# Altium schematic sheet Breakoutboard.SchDoc
size 699 x 500 mm; SheetNumber: 1; SheetTotal: 1
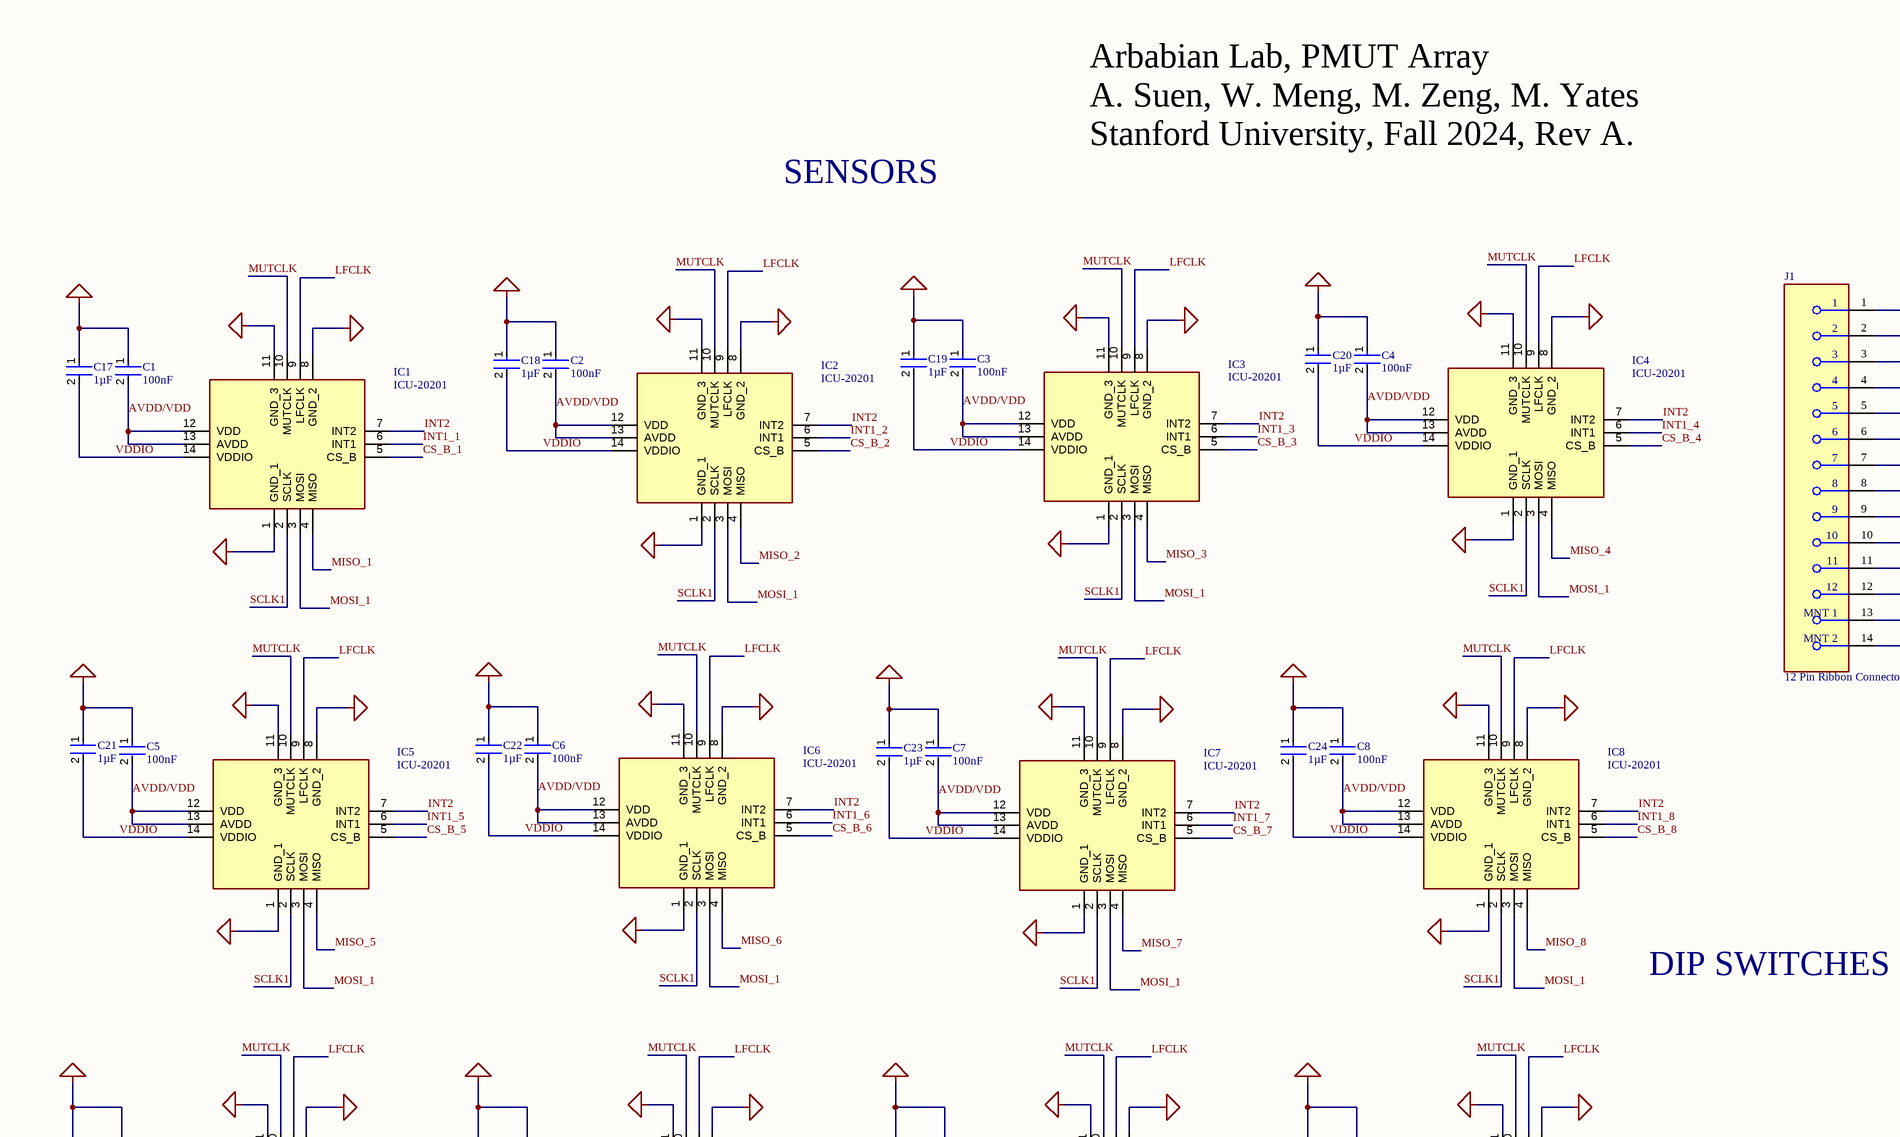
[diagram p0: Breakoutboard.SchDoc, top left]
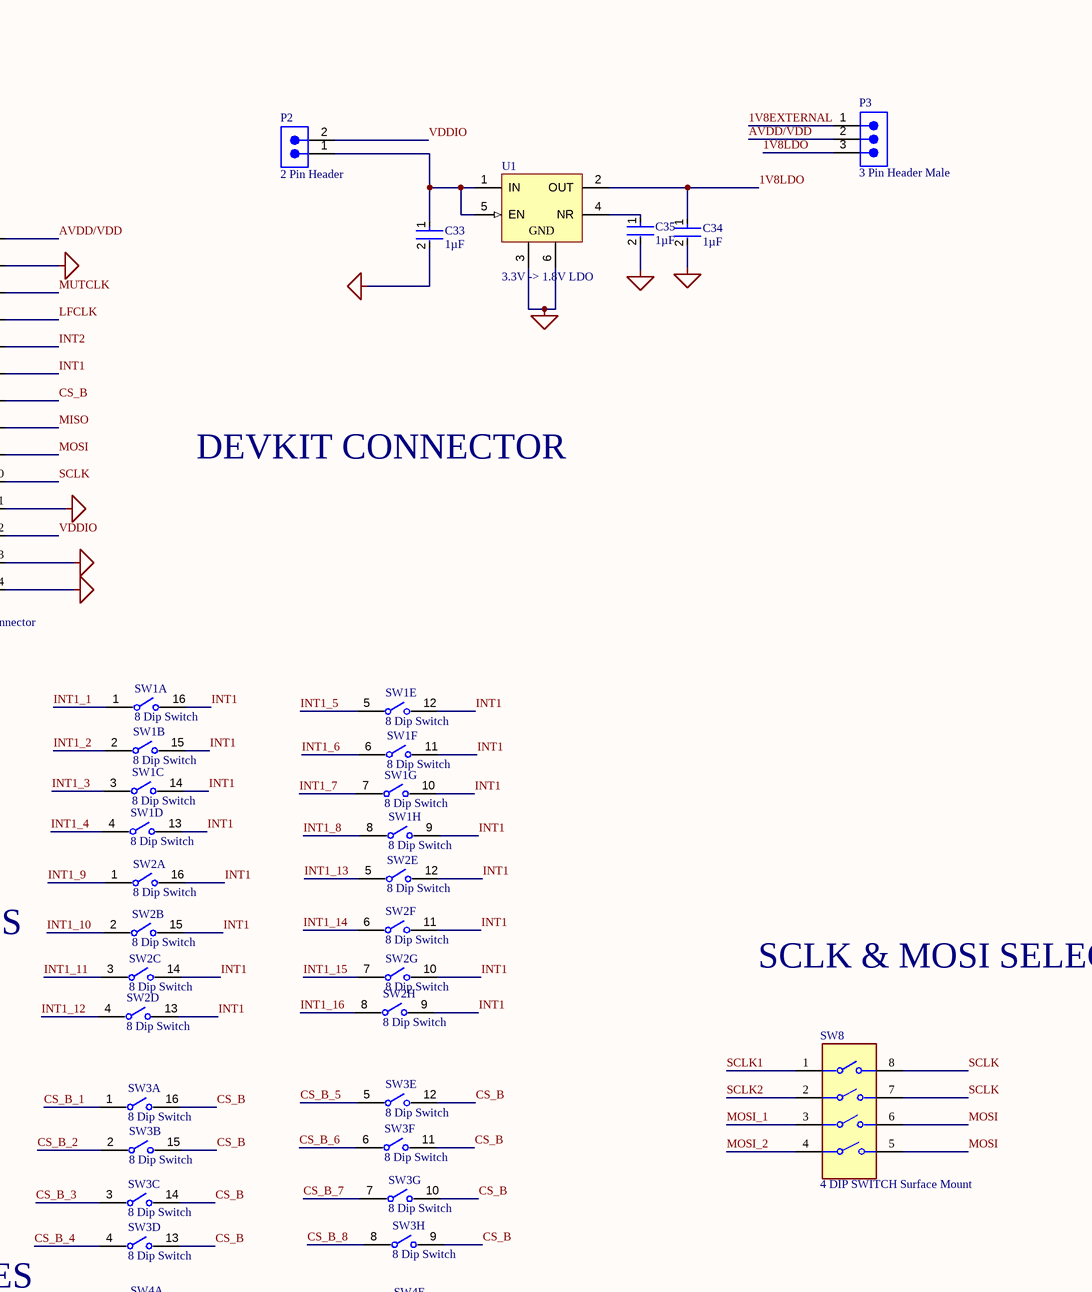
[diagram p1: Breakoutboard.SchDoc, top right]
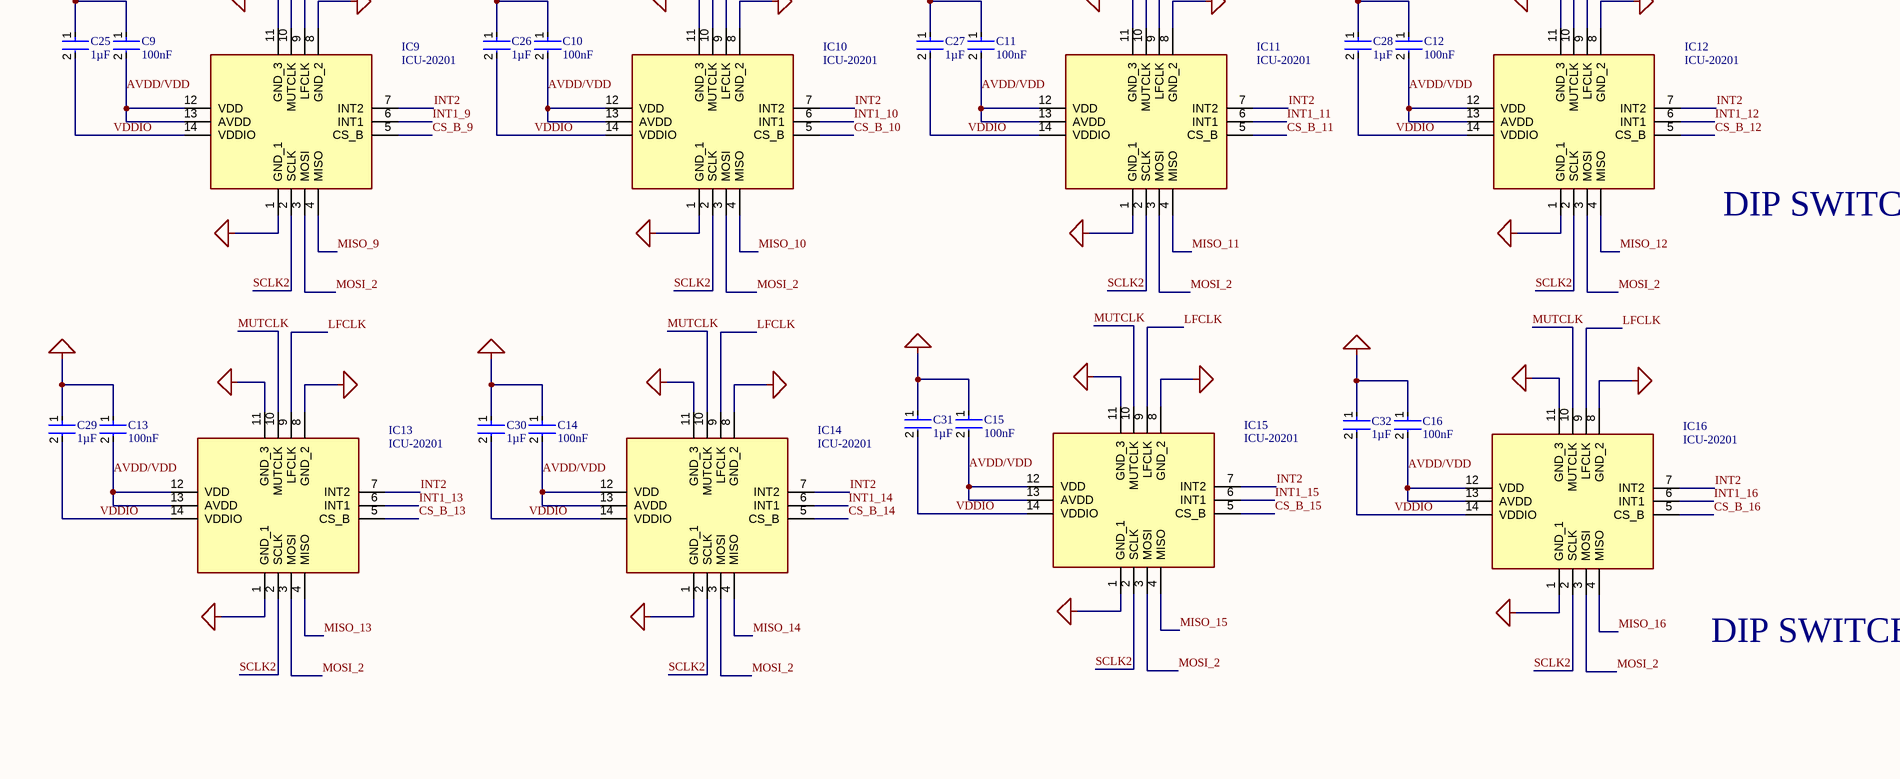
[diagram p2: Breakoutboard.SchDoc, bottom left]
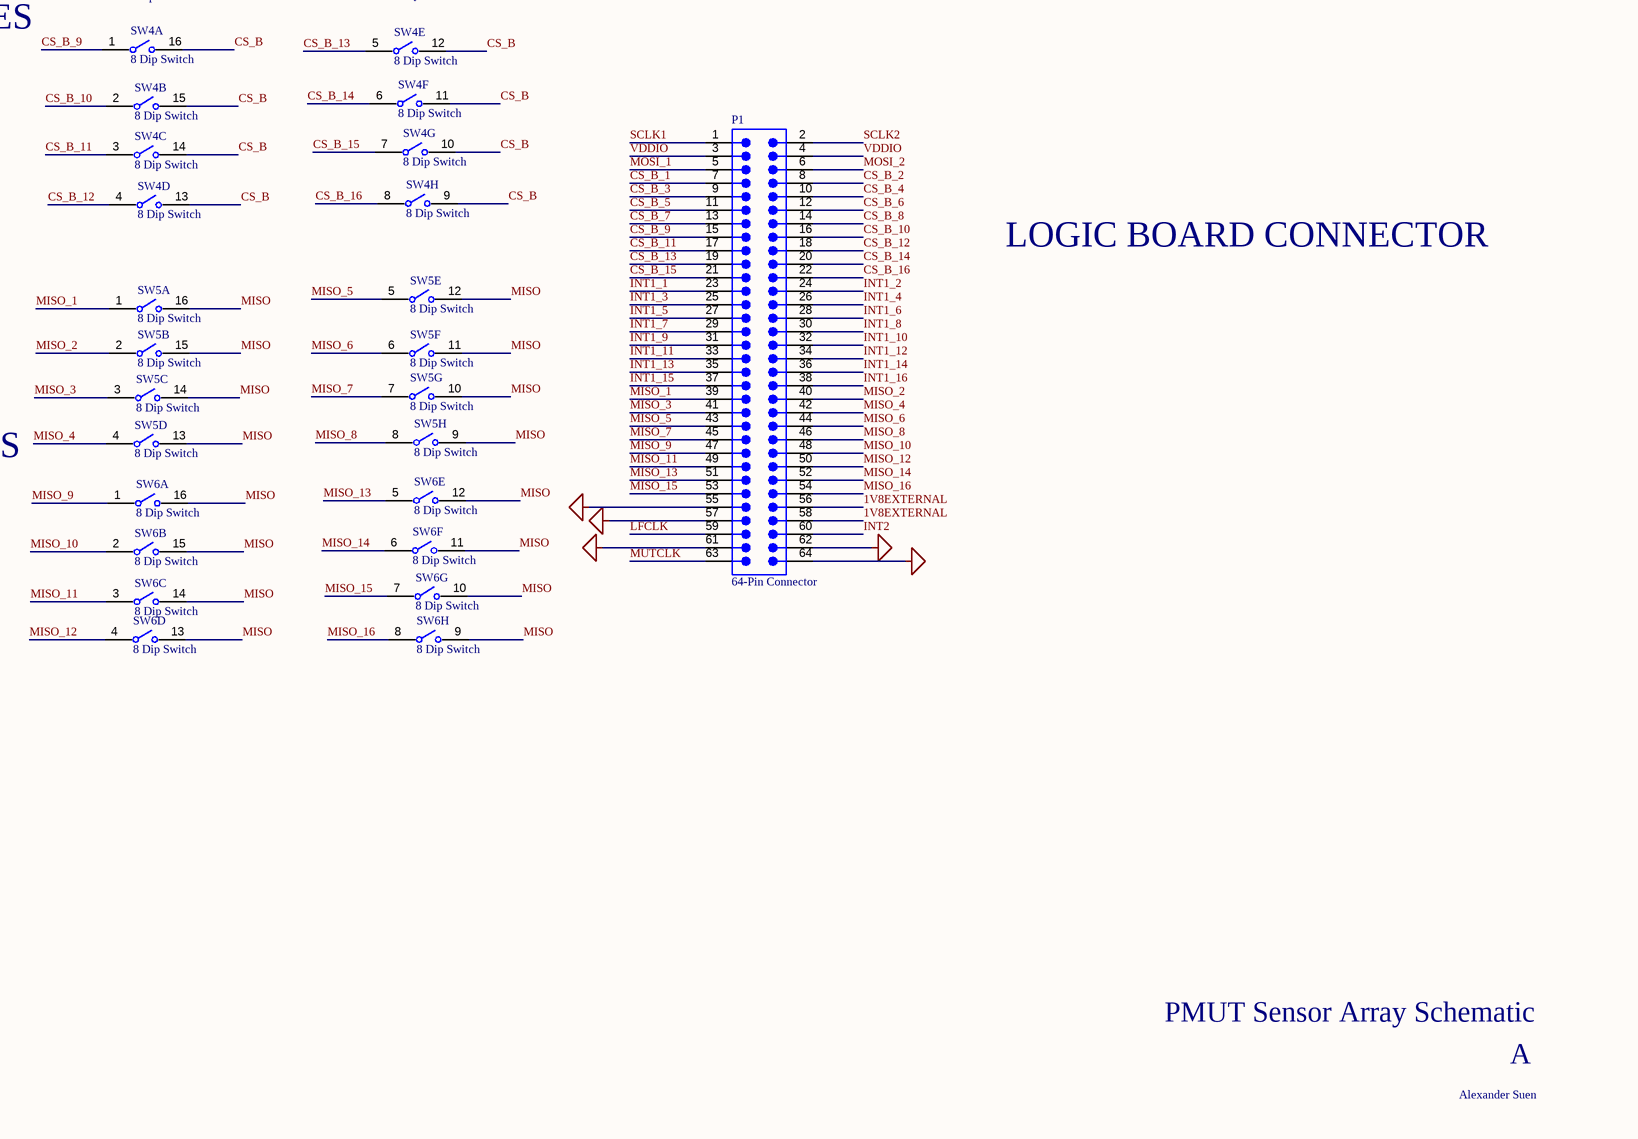
[diagram p3: Breakoutboard.SchDoc, bottom right]

## Parts
C1  value 100nF  [FP-CL17-IPC_B]  (hidden comment: 0.1 uF Capacitator)
C2  value 100nF  [FP-CL17-IPC_B]  (hidden comment: 0.1 uF Capacitator)
C3  value 100nF  [FP-CL17-IPC_B]  (hidden comment: 0.1 uF Capacitator)
C4  value 100nF  [FP-CL17-IPC_B]  (hidden comment: 0.1 uF Capacitator)
C5  value 100nF  [FP-CL17-IPC_B]  (hidden comment: 0.1 uF Capacitator)
C6  value 100nF  [FP-CL17-IPC_B]  (hidden comment: 0.1 uF Capacitator)
C7  value 100nF  [FP-CL17-IPC_B]  (hidden comment: 0.1 uF Capacitator)
C8  value 100nF  [FP-CL17-IPC_B]  (hidden comment: 0.1 uF Capacitator)
C9  value 100nF  [FP-CL17-IPC_B]  (hidden comment: 0.1 uF Capacitator)
C10  value 100nF  [FP-CL17-IPC_B]  (hidden comment: 0.1 uF Capacitator)
C11  value 100nF  [FP-CL17-IPC_B]  (hidden comment: 0.1 uF Capacitator)
C12  value 100nF  [FP-CL17-IPC_B]  (hidden comment: 0.1 uF Capacitator)
C13  value 100nF  [FP-CL17-IPC_B]  (hidden comment: 0.1 uF Capacitator)
C14  value 100nF  [FP-CL17-IPC_B]  (hidden comment: 0.1 uF Capacitator)
C15  value 100nF  [FP-CL17-IPC_B]  (hidden comment: 0.1 uF Capacitator)
C16  value 100nF  [FP-CL17-IPC_B]  (hidden comment: 0.1 uF Capacitator)
C17  value 1µF  [FP-CC0603-DA-IPC_B]  (hidden comment: 1 uF Capacitator)
C18  value 1µF  [FP-CC0603-DA-IPC_B]  (hidden comment: 1 uF Capacitator)
C19  value 1µF  [FP-CC0603-DA-IPC_B]  (hidden comment: 1 uF Capacitator)
C20  value 1µF  [FP-CC0603-DA-IPC_B]  (hidden comment: 1 uF Capacitator)
C21  value 1µF  [FP-CC0603-DA-IPC_B]  (hidden comment: 1 uF Capacitator)
C22  value 1µF  [FP-CC0603-DA-IPC_B]  (hidden comment: 1 uF Capacitator)
C23  value 1µF  [FP-CC0603-DA-IPC_B]  (hidden comment: 1 uF Capacitator)
C24  value 1µF  [FP-CC0603-DA-IPC_B]  (hidden comment: 1 uF Capacitator)
C25  value 1µF  [FP-CC0603-DA-IPC_B]  (hidden comment: 1 uF Capacitator)
C26  value 1µF  [FP-CC0603-DA-IPC_B]  (hidden comment: 1 uF Capacitator)
C27  value 1µF  [FP-CC0603-DA-IPC_B]  (hidden comment: 1 uF Capacitator)
C28  value 1µF  [FP-CC0603-DA-IPC_B]  (hidden comment: 1 uF Capacitator)
C29  value 1µF  [FP-CC0603-DA-IPC_B]  (hidden comment: 1 uF Capacitator)
C30  value 1µF  [FP-CC0603-DA-IPC_B]  (hidden comment: 1 uF Capacitator)
C31  value 1µF  [FP-CC0603-DA-IPC_B]  (hidden comment: 1 uF Capacitator)
C32  value 1µF  [FP-CC0603-DA-IPC_B]  (hidden comment: 1 uF Capacitator)
C33  value 1µF  [FP-CC0603-DA-IPC_B]  (hidden comment: 1 uF Capacitator)
C34  value 1µF  [FP-CC0603-DA-IPC_B]  (hidden comment: 1 uF Capacitator)
C35  value 1µF  [FP-CC0603-DA-IPC_B]  (hidden comment: 1 uF Capacitator)
IC1  ICU-20201  [ICU20201]
IC2  ICU-20201  [ICU20201]
IC3  ICU-20201  [ICU20201]
IC4  ICU-20201  [ICU20201]
IC5  ICU-20201  [ICU20201]
IC6  ICU-20201  [ICU20201]
IC7  ICU-20201  [ICU20201]
IC8  ICU-20201  [ICU20201]
IC9  ICU-20201  [ICU20201]
IC10  ICU-20201  [ICU20201]
IC11  ICU-20201  [ICU20201]
IC12  ICU-20201  [ICU20201]
IC13  ICU-20201  [ICU20201]
IC14  ICU-20201  [ICU20201]
IC15  ICU-20201  [ICU20201]
IC16  ICU-20201  [ICU20201]
J1  12 Pin Ribbon Connector  [FP-505110-1292-MFG]
P1  64-Pin Connector  [61306421021]
P2  2 Pin Header  [61300211121]
P3  3 Pin Header Male  [61300311121]
SW1  8 Dip Switch  [FP-1-1571983-1-MFG]  (parts A,B,C,D,E,F,G,H of 8)
SW2  8 Dip Switch  [FP-1-1571983-1-MFG]  (parts A,B,C,D,E,F,G,H of 8)
SW3  8 Dip Switch  [FP-1-1571983-1-MFG]  (parts A,B,C,D,E,F,G,H of 8)
SW4  8 Dip Switch  [FP-1-1571983-1-MFG]  (parts A,B,C,D,E,F,G,H of 8)
SW5  8 Dip Switch  [FP-1-1571983-1-MFG]  (parts A,B,C,D,E,F,G,H of 8)
SW6  8 Dip Switch  [FP-1-1571983-1-MFG]  (parts A,B,C,D,E,F,G,H of 8)
SW8  4 DIP SWITCH Surface Mount  [FP-218-4LPSTR-MFG]
U1  3.3V -> 1.8V LDO  [DCQ0006A_N]

## Nets
GND: C1.1 C2.1 C3.1 C4.1 C5.1 C6.1 C7.1 C8.1 C9.1 C10.1 C11.1 C12.1 C13.1 C14.1 C15.1 C16.1 C17.1 C18.1 C19.1 C20.1 C21.1 C22.1 C23.1 C24.1 C25.1 C26.1 C27.1 C28.1 C29.1 C30.1 C31.1 C32.1 C33.2 C34.2 C35.2 IC1.1(GND_1) IC1.8(GND_2) IC1.11(GND_3) IC2.1(GND_1) IC2.8(GND_2) IC2.11(GND_3) IC3.1(GND_1) IC3.8(GND_2) IC3.11(GND_3) IC4.1(GND_1) IC4.8(GND_2) IC4.11(GND_3) IC5.1(GND_1) IC5.8(GND_2) IC5.11(GND_3) IC6.1(GND_1) IC6.8(GND_2) IC6.11(GND_3) IC7.1(GND_1) IC7.8(GND_2) IC7.11(GND_3) IC8.1(GND_1) IC8.8(GND_2) IC8.11(GND_3) IC9.1(GND_1) IC9.8(GND_2) IC9.11(GND_3) IC10.1(GND_1) IC10.8(GND_2) IC10.11(GND_3) IC11.1(GND_1) IC11.8(GND_2) IC11.11(GND_3) IC12.1(GND_1) IC12.8(GND_2) IC12.11(GND_3) IC13.1(GND_1) IC13.8(GND_2) IC13.11(GND_3) IC14.1(GND_1) IC14.8(GND_2) IC14.11(GND_3) IC15.1(GND_1) IC15.8(GND_2) IC15.11(GND_3) IC16.1(GND_1) IC16.8(GND_2) IC16.11(GND_3) J1.2 J1.11 J1.13(MNT_1) J1.14(MNT_2) P1.55 P1.57 P1.61 P1.62 P1.64 U1.3(GND) U1.6(GND)
1V8EXTERNAL: P1.56 P1.58 P3.1
1V8LDO: C34.1 P3.3 U1.2(OUT)
AVDD/VDD: C1.2 C2.2 C3.2 C4.2 C5.2 C6.2 C7.2 C8.2 C9.2 C10.2 C11.2 C12.2 C13.2 C14.2 C15.2 C16.2 IC1.12(VDD) IC1.13(AVDD) IC2.12(VDD) IC2.13(AVDD) IC3.12(VDD) IC3.13(AVDD) IC4.12(VDD) IC4.13(AVDD) IC5.12(VDD) IC5.13(AVDD) IC6.12(VDD) IC6.13(AVDD) IC7.12(VDD) IC7.13(AVDD) IC8.12(VDD) IC8.13(AVDD) IC9.12(VDD) IC9.13(AVDD) IC10.12(VDD) IC10.13(AVDD) IC11.12(VDD) IC11.13(AVDD) IC12.12(VDD) IC12.13(AVDD) IC13.12(VDD) IC13.13(AVDD) IC14.12(VDD) IC14.13(AVDD) IC15.12(VDD) IC15.13(AVDD) IC16.12(VDD) IC16.13(AVDD) J1.1 P3.2
CS_B: J1.7 SW3.9 SW3.10 SW3.11 SW3.12 SW3.13 SW3.14 SW3.15 SW3.16 SW4.9 SW4.10 SW4.11 SW4.12 SW4.13 SW4.14 SW4.15 SW4.16
CS_B_1: IC1.5(CS_B) P1.7 SW3.1
CS_B_2: IC2.5(CS_B) P1.8 SW3.2
CS_B_3: IC3.5(CS_B) P1.9 SW3.3
CS_B_4: IC4.5(CS_B) P1.10 SW3.4
CS_B_5: IC5.5(CS_B) P1.11 SW3.5
CS_B_6: IC6.5(CS_B) P1.12 SW3.6
CS_B_7: IC7.5(CS_B) P1.13 SW3.7
CS_B_8: IC8.5(CS_B) P1.14 SW3.8
CS_B_9: IC9.5(CS_B) P1.15 SW4.1
CS_B_10: IC10.5(CS_B) P1.16 SW4.2
CS_B_11: IC11.5(CS_B) P1.17 SW4.3
CS_B_12: IC12.5(CS_B) P1.18 SW4.4
CS_B_13: IC13.5(CS_B) P1.19 SW4.5
CS_B_14: IC14.5(CS_B) P1.20 SW4.6
CS_B_15: IC15.5(CS_B) P1.21 SW4.7
CS_B_16: IC16.5(CS_B) P1.22 SW4.8
INT1: J1.6 SW1.9 SW1.10 SW1.11 SW1.12 SW1.13 SW1.14 SW1.15 SW1.16 SW2.9 SW2.10 SW2.11 SW2.12 SW2.13 SW2.14 SW2.15 SW2.16
INT1_1: IC1.6(INT1) P1.23 SW1.1
INT1_2: IC2.6(INT1) P1.24 SW1.2
INT1_3: IC3.6(INT1) P1.25 SW1.3
INT1_4: IC4.6(INT1) P1.26 SW1.4
INT1_5: IC5.6(INT1) P1.27 SW1.5
INT1_6: IC6.6(INT1) P1.28 SW1.6
INT1_7: IC7.6(INT1) P1.29 SW1.7
INT1_8: IC8.6(INT1) P1.30 SW1.8
INT1_9: IC9.6(INT1) P1.31 SW2.1
INT1_10: IC10.6(INT1) P1.32 SW2.2
INT1_11: IC11.6(INT1) P1.33 SW2.3
INT1_12: IC12.6(INT1) P1.34 SW2.4
INT1_13: IC13.6(INT1) P1.35 SW2.5
INT1_14: IC14.6(INT1) P1.36 SW2.6
INT1_15: IC15.6(INT1) P1.37 SW2.7
INT1_16: IC16.6(INT1) P1.38 SW2.8
INT2: IC1.7(INT2) IC2.7(INT2) IC3.7(INT2) IC4.7(INT2) IC5.7(INT2) IC6.7(INT2) IC7.7(INT2) IC8.7(INT2) IC9.7(INT2) IC10.7(INT2) IC11.7(INT2) IC12.7(INT2) IC13.7(INT2) IC14.7(INT2) IC15.7(INT2) IC16.7(INT2) J1.5 P1.60
LFCLK: IC1.9(LFCLK) IC2.9(LFCLK) IC3.9(LFCLK) IC4.9(LFCLK) IC5.9(LFCLK) IC6.9(LFCLK) IC7.9(LFCLK) IC8.9(LFCLK) IC9.9(LFCLK) IC10.9(LFCLK) IC11.9(LFCLK) IC12.9(LFCLK) IC13.9(LFCLK) IC14.9(LFCLK) IC15.9(LFCLK) IC16.9(LFCLK) J1.4 P1.59
MISO: J1.8 SW5.9 SW5.10 SW5.11 SW5.12 SW5.13 SW5.14 SW5.15 SW5.16 SW6.9 SW6.10 SW6.11 SW6.12 SW6.13 SW6.14 SW6.15 SW6.16
MISO_1: IC1.4(MISO) P1.39 SW5.1
MISO_2: IC2.4(MISO) P1.40 SW5.2
MISO_3: IC3.4(MISO) P1.41 SW5.3
MISO_4: IC4.4(MISO) P1.42 SW5.4
MISO_5: IC5.4(MISO) P1.43 SW5.5
MISO_6: IC6.4(MISO) P1.44 SW5.6
MISO_7: IC7.4(MISO) P1.45 SW5.7
MISO_8: IC8.4(MISO) P1.46 SW5.8
MISO_9: IC9.4(MISO) P1.47 SW6.1
MISO_10: IC10.4(MISO) P1.48 SW6.2
MISO_11: IC11.4(MISO) P1.49 SW6.3
MISO_12: IC12.4(MISO) P1.50 SW6.4
MISO_13: IC13.4(MISO) P1.51 SW6.5
MISO_14: IC14.4(MISO) P1.52 SW6.6
MISO_15: IC15.4(MISO) P1.53 SW6.7
MISO_16: IC16.4(MISO) P1.54 SW6.8
MOSI: J1.9 SW8.5 SW8.6
MOSI_1: IC1.3(MOSI) IC2.3(MOSI) IC3.3(MOSI) IC4.3(MOSI) IC5.3(MOSI) IC6.3(MOSI) IC7.3(MOSI) IC8.3(MOSI) P1.5 SW8.3
MOSI_2: IC9.3(MOSI) IC10.3(MOSI) IC11.3(MOSI) IC12.3(MOSI) IC13.3(MOSI) IC14.3(MOSI) IC15.3(MOSI) IC16.3(MOSI) P1.6 SW8.4
MUTCLK: IC1.10(MUTCLK) IC2.10(MUTCLK) IC3.10(MUTCLK) IC4.10(MUTCLK) IC5.10(MUTCLK) IC6.10(MUTCLK) IC7.10(MUTCLK) IC8.10(MUTCLK) IC9.10(MUTCLK) IC10.10(MUTCLK) IC11.10(MUTCLK) IC12.10(MUTCLK) IC13.10(MUTCLK) IC14.10(MUTCLK) IC15.10(MUTCLK) IC16.10(MUTCLK) J1.3 P1.63
SCLK: J1.10 SW8.7 SW8.8
SCLK1: IC1.2(SCLK) IC2.2(SCLK) IC3.2(SCLK) IC4.2(SCLK) IC5.2(SCLK) IC6.2(SCLK) IC7.2(SCLK) IC8.2(SCLK) P1.1 SW8.1
SCLK2: IC9.2(SCLK) IC10.2(SCLK) IC11.2(SCLK) IC12.2(SCLK) IC13.2(SCLK) IC14.2(SCLK) IC15.2(SCLK) IC16.2(SCLK) P1.2 SW8.2
VDDIO: C17.2 C18.2 C19.2 C20.2 C21.2 C22.2 C23.2 C24.2 C25.2 C26.2 C27.2 C28.2 C29.2 C30.2 C31.2 C32.2 IC1.14(VDDIO) IC2.14(VDDIO) IC3.14(VDDIO) IC4.14(VDDIO) IC5.14(VDDIO) IC6.14(VDDIO) IC7.14(VDDIO) IC8.14(VDDIO) IC9.14(VDDIO) IC10.14(VDDIO) IC11.14(VDDIO) IC12.14(VDDIO) IC13.14(VDDIO) IC14.14(VDDIO) IC15.14(VDDIO) IC16.14(VDDIO) J1.12 P1.3 P1.4 P2.2
NetC33_1: C33.1 P2.1 U1.1(IN) U1.5(EN)
NetC35_1: C35.1 U1.4(NR)

## Notes on the sheet
- SENSORS
- Arbabian Lab, PMUT Array
  A. Suen, W. Meng, M. Zeng, M. Yates
  Stanford University, Fall 2024, Rev A.
- DEVKIT CONNECTOR
- DIP SWITCHES
- SCLK & MOSI SELECTOR
- LOGIC BOARD CONNECTOR
- PMUT Sensor Array Schematic
- Alexander Suen
- A
- DWG. NO.
- REV.
- SHT.
- REVISION
- DESCRIPTION
- DATE
- APPROVED
- THIS DOCUMENT AND THE DATA DISCLOSED HEREIN OR HEREWITH IS THE PROPERTY OF ALTIUM LIMITED AND MAY BE FREELY DISTRIBUTED IN WHOLE. NO RIGHTS ARE RESERVED OR EXPRESS OR IMPLIED WARANTEE GIVEN.
- ENG:
- DSN:
- APPROVALS
- PROJECT
- DOCUMENT REVISION:
- DESIGN ITEM:
- CHK:
- BOM:
- REFERENCE DOCUMENTS
- PROJECT REVISION:
- TITLE
- FAB DWG:
- PCB DWG:
- ASSY DWG:
- SCALE:
- SIZE
- D
- CAGE CODE
- FILE NAME
- DWG NO.
- SHEET
- OF
- REV

## Library data of the parts
C1-C16 = CMP-001-00084-1: Ceramic Capacitor, Multilayer, Ceramic, 10V, 10% +Tol, 10% -Tol, X7R, 15% TC, 0.1uF, Surface Mount, 0402; Multilayer: Yes; Width: 0.5mm; Min Operating Temperature: -55°C; JESD-609 Code: e3; Package Shape: Rectangular; Max Operating Temperature: 125°C; Height: 0.5mm; Reach SVHC Compliant: Yes; Dielectric Material: Ceramic; Tolerance  (fill in as +-): 10%; Tolerance (fill in as +-): 10%; Case/Package: 0402; Packaging: Tape and Reel; Capacitor Type: Ceramic; Rated DC Voltage (URdc): 10V; Termination: Wraparound; Temperature Characteristics Code: X7R; Length: 1mm; Terminal Finish: Nickel; RoHS Compliant: Yes; Pins: 2; Package Style: SMTMeter; Mounting Technology: Surface Mount
C17-C35 = CMP-001-00085-1: Ceramic Capacitor, Multilayer, Ceramic, 16V, 10% +Tol, 10% -Tol, X7R, 15% TC, 1uF, Surface Mount, 0603; Multilayer: Yes; Rated DC Voltage (URdc): 16V; Package Style: SMTMeter; Height: 0.8mm; Tolerance (fill in as +-): 10%; Min Operating Temperature: -55°C; Max Operating Temperature: 125°C; Termination: Wraparound; Tolerance  (fill in as +-): 10%; Terminal Finish: Nickel; RoHS Compliant: Yes; Capacitor Type: Ceramic; Length: 1.6mm; Temperature Characteristics Code: X7R; Reach SVHC Compliant: Yes; JESD-609 Code: e3; Package Shape: Rectangular; Packaging: Tape and Reel; Pins: 2; Width: 0.8mm; Mounting Technology: Surface Mount; Case/Package: 0603; Dielectric Material: Ceramic
IC1-IC16 = ICU-20201: Integrated Circuit; Manufacturer_Name: TDK; Datasheet Link: https://invensense.tdk.com/wp-content/uploads/2023/06/ds-000478_icu-20201-datasheet.pdf; Height: 1.36mm; Manufacturer_Part_Number: ICU-20201; Mouser Part Number: 410-ICU-20201; Mouser Price/Stock: https://www.mouser.co.uk/ProductDetail/TDK-InvenSense/ICU-20201?qs=tlsG%2FOw5FFgKqFXdb%252Bw4xQ%3D%3D; Arrow Part Number: ICU-20201; Arrow Price/Stock: https://www.arrow.com/en/products/icu-20201/invensense?region=nac
J1 = CMP-002-00072-1: Conn FFC/FPC Connector SKT 12 POS 0.5mm Solder RA SMD Easy-On™ T/R
P1 = CMP-002-00073-1: Board Connector, 64 Contact(s), 2 Row(s), Male, Right Angle, 0.1 inch Pitch, Solder Terminal, Locking, Black Insulator, Plug; Manufacturer Series: 613; Body Depth: 0.259inch; Number Of Connectors: 1; Contact Pattern: RECTANGULAR; Dielectric Withstanding Voltage (AC): 500V; Contact Resistance: 20mR; Number of Contacts: 64; Body Breadth: 0.2inch; Number Of PCB Rows: 2; Insulation Resistance: 1GR; Body Length: 3.2inch; Rated Current (Signal): 3A; Reliability: COMMERCIAL; Reference Standard: UL; PCB Contact Row Spacing: 2.54mm; Contact Style: SQ PIN-SKT; Connector Type: BOARD CONNECTOR; Mating Contact Pitch: 0.1inch; Reach SVHC Compliant: Yes; Insulation Material: Polybutylene; Body/Shell Style: PLUG; Contact Gender: Male; Mounting Style: RIGHT ANGLE; Contact Finish - Mating: GOLD; Contact Finish - Termination: Gold (Au) - with Nickel (Ni) barrier; Mounting Technology: Board; Mounting Option 1: LOCKING; Terminal Pitch: 2.54mm; Max Operating Temperature: 125°C; Termination: Solder; JESD-609 Code: e4; Min Operating Temperature: -40°C; Number of Rows Loaded: 2; Insulation Color: Black; Contact Material: Copper Alloy; Terminal Length: 0.118inch; RoHS Compliant: Yes; PCB Contact Pattern: RECTANGULAR; Mating Contact Row Spacing: 0.1inch
P2 = CMP-002-00080-1: Board Connector, 2 Contact(s), 1 Row(s), Male, Straight, 0.1 inch Pitch, Solder Terminal, Locking, Black Insulator, Plug; IEC Conformance: No; Reliability: COMMERCIAL; Rated Current (Signal): 3A; Insulation Resistance: 1GR; Number of Rows Loaded: 1; Contact Resistance: 20mR; Contact Pattern: RECTANGULAR; Dielectric Withstanding Voltage (AC): 500V; Option: General Purpose; Reference Standard: UL; Body Length: 0.2inch; Contact Style: SQ PIN-SKT; Number of Contacts: 2; MIL Conformance: No; Min Operating Temperature: -40°C; Mounting Style: STRAIGHT; JESD-609 Code: e4; Insulation Color: Black; Body Breadth: 0.1inch; Mounting Option 1: LOCKING; Terminal Pitch: 2.54mm; RoHS Compliant: Yes; Body Depth: 0.1inch; Mounting Technology: Board; Mating Contact Pitch: 0.1inch; Contact Material: Copper Alloy; Contact Gender: Male; Filter Feature: No; Terminal Length: 0.118inch; Contact Finish - Termination: Gold (Au) - with Nickel (Ni) barrier; Insulation Material: Polybutylene; Body/Shell Style: PLUG; Max Operating Temperature: 125°C; Contact Finish - Mating: GOLD; Number Of Connectors: 1; Mixed Contacts: No; Connector Type: BOARD CONNECTOR; DIN Conformance: No; Reach SVHC Compliant: Yes; PCB Contact Pattern: RECTANGULAR; Termination: Solder; Flammability Rating: UL94 V-0
P3 = CMP-002-00081-1: Board Connector, 3 Contact(s), 1 Row(s), Male, Straight, 0.1 inch Pitch, Solder Terminal, Locking, Black Insulator, Plug; Contact Pattern: RECTANGULAR; Insulation Resistance: 1GR; Contact Style: SQ PIN-SKT; Dielectric Withstanding Voltage (AC): 500V; Number Of Connectors: 1; Contact Resistance: 20mR; Body Length: 0.3inch; Rated Current (Signal): 3A; Number of Contacts: 3; Reliability: COMMERCIAL; Reference Standard: UL; Contact Material: Copper Alloy; Terminal Length: 0.118inch; JESD-609 Code: e4; Body Depth: 0.1inch; Insulation Color: Black; Connector Type: BOARD CONNECTOR; Reach SVHC Compliant: Yes; Insulation Material: Polybutylene; Mating Contact Pitch: 0.1inch; Mounting Option 1: LOCKING; Min Operating Temperature: -40°C; Contact Gender: Male; Mounting Style: STRAIGHT; RoHS Compliant: Yes; Contact Finish - Mating: GOLD; Termination: Solder; Body Breadth: 0.1inch; Max Operating Temperature: 125°C; Contact Finish - Termination: Gold (Au) - with Nickel (Ni) barrier; Mounting Technology: Board; PCB Contact Pattern: RECTANGULAR; Number of Rows Loaded: 1; Terminal Pitch: 2.54mm; Body/Shell Style: PLUG
SW1-SW6 = CMP-002-00077-1: Slide Dip Switch, 8 Switches, SPST, Latched, 0.025A, 24VDC, Solder Terminal, Surface Mount-straight; Manufacturer Series: 1571983; Contact Voltage(DC)-Max: 24V; Body Height: 2.31mm; Contact Current(DC)-Max: 25mA; Sealing: TAPE SEALED; Body Breadth: 6.2mm; Body Length or Diameter: 11.29mm; Contact DC Max Rating R Load: .025A@24VDC; Number of Switch Sections: 8; Switch Action: LATCHED; Min Operating Temperature: -30°C; Termination: Solder; Mounting Technology: Surface Mount; Packaging: Tape and Reel; RoHS Compliant: Yes; Switch Type: Slide Dip; Max Operating Temperature: 85°C; Switch Function: SPST
SW8 = CMP-002-00079-1: Slide Dip Switch, 4 Switches, SPST, Off-on, Latched, 0.025A, 24VDC, Solder Terminal, Surface Mount-straight; Body Breadth: 5.8mm; Body Length or Diameter: 6.25mm; Contact DC Max Rating R Load: .025A@24VDC; Insulation Resistance: 100MR; End Contact Plating: Gold; Contact Current(DC)-Max: 25mA; Number of Switch Sections: 4; Body Height: 2.65mm; End Contact Material: Copper; Sealing: BOTTOM SEALED; TOP TAPE SEALED; Contact Voltage(DC)-Max: 24V; Terminal Material: Bronze; Terminal Finish: Gold; Max Operating Temperature: 85°C; Actuator Type: SLIDE; Packaging: Tape and Reel; RoHS Compliant: Yes; Min Operating Temperature: -55°C; Termination: Solder; Number of Positions: 4; Switch Action: LATCHED; Center Contact Plating: Gold; Reach SVHC Compliant: Yes; Mounting Technology: Surface Mount; Switch Function: SPST; Contact Material: Copper; Contact Function: Off-On; Switch Type: Slide Dip
U1 = CMP-019-00049-1: Fixed Positive LDO Regulator, 1.8V, 0.5V Dropout, BICMOS, PDSO6; Max Supply Voltage: 5.5V; Dropout Voltage1-Max: 500mV; Output Voltage1-Max: 1.854V; Qualification Status: Not Qualified; Output Voltage1-Min: 1.746V; Number of Outputs: 1; Min Input Voltage: 2.2V; Voltage Tolerance-Max: 3%; Package Body Material: Plastic; Regulator Type: FIXED POSITIVE SINGLE OUTPUT LDO REGULATOR; Input Voltage Absolute-Max: 6V; Output Current1-Max: 1A; Pins: 6; Terminal Finish: Tin; Terminal Form: Gull Wing; Packaging: Rail/Tube; Technology: BICMOS; RoHS Compliant: Yes; Moisture Sensitivity Level: 2; Terminal Position: DUAL; Output Voltage1-Nom: 1.8V; Package Style: SMALL OUTLINEMeter; JESD-30 Code: R-PDSO-G6; Width: 3.5mm; Operating Temperature, TJ-Min: -40°C; Reach SVHC Compliant: Yes; Terminal Pitch: 1.27mm; Adjustability: FIXED; Operating Temperature, TJ-Max: 125°C; Length: 6.5mm; Height - Seated (Max): 1.8mm; Surface Mount: Yes; JESD-609 Code: e3; Package Shape: Rectangular; Channels: 1; Case/Package: SOP; Peak Reflow Temperature (Cel): 260°C